# Altium schematic sheet 5V-12Visolated.SchDoc
size A
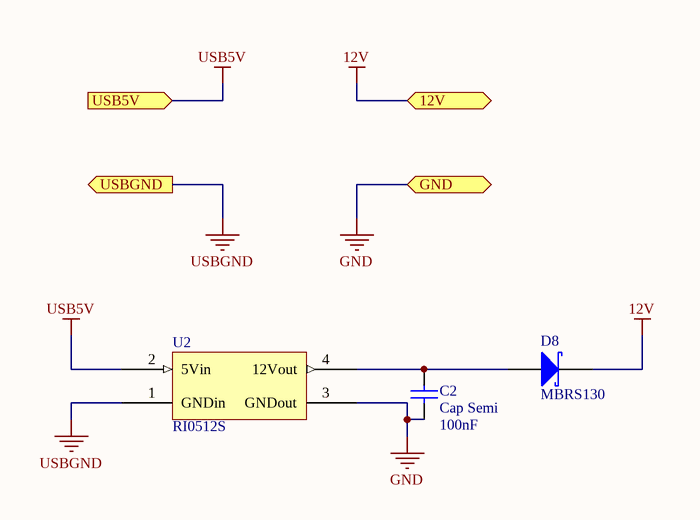
[diagram p0: 5V-12Visolated.SchDoc]

## Parts
C2  Cap Semi  value 100nF  [0603]
D8  MBRS130  [SMB]
U2  RI0512S  [RI0512S]

## Ports
12V, GND, USB5V (in), USBGND (out)

## Nets
12V: D8.K ; port 12V
GND: C2.2 U2.3(GNDout) ; port GND
USB5V: U2.2(5Vin) ; port USB5V
USBGND: U2.1(GNDin) ; port USBGND
NetC2_1: C2.1 D8.A U2.4(12Vout)

## Library data of the parts
C2 = Cap Semi: Capacitor (Semiconductor SIM Model); Published: 8-Jun-2000; LatestRevisionDate: 17-Jul-2002; LatestRevisionNote: Re-released for DXP Platform.; PackageReference: C1206; Publisher: Altium Limited; Element14: 9406140; Element14 Price: 0.13
D8 = D SCHOTTKY: Schottky Diode; Revision: July-2002: Re-released for DXP Platform.; Element14: 9556931; Element14 Price: 0.43; Digikey: MBRS130LT3GOSCT-ND; Digikey Price: 0.311
U2 = RI0512S: 5V-12V isolated; Element14 (low stock): 1793280; Element14 Price: 10.58; Digikey: 945-1190-ND; Digikey Price: 6.67